# Altium schematic sheet EMoC_Contoller.SchDoc
size A4
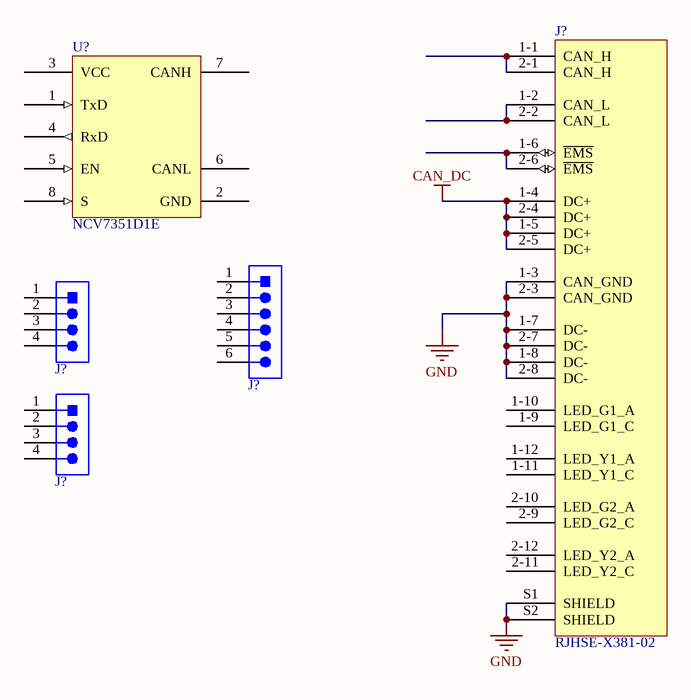
[diagram p0: EMoC_Contoller.SchDoc]

## Parts
(Parts that share a designator on the sheet are numbered #1, #2 ... from top to bottom, then left to right.)
J?#1  S6B-ZR  [S6B-ZR]  (value not drawn)
J?#2  1744426-4  [1744426-4]  (value not drawn)
J?#3  RJHSE-X381-02  [RJHSE-X38X-02]
J?#4  1744426-4  [1744426-4]  (value not drawn)
U?  NCV7351D1E  [SOIC127P600X175-8N]

## Nets
CAN_DC: J?#3.1-4(DC+) J?#3.1-5(DC+) J?#3.2-4(DC+) J?#3.2-5(DC+)
GND: J?#3.1-3(CAN_GND) J?#3.1-7(DC-) J?#3.1-8(DC-) J?#3.2-3(CAN_GND) J?#3.2-7(DC-) J?#3.2-8(DC-) J?#3.S1(SHIELD) J?#3.S2(SHIELD)
NetJ?#3_1-1: J?#3.1-1(CAN_H) J?#3.2-1(CAN_H)
NetJ?#3_1-2: J?#3.1-2(CAN_L) J?#3.2-2(CAN_L)
NetJ?#3_1-6: J?#3.1-6(~{EMS}) J?#3.2-6(~{EMS})

Not connected (* = marked no-connect by the designer): J?#1 1 2 3 4 5 6; J?#2 1 2 3 4; J?#3 1-9(LED_G1_C) 1-10(LED_G1_A) 1-11(LED_Y1_C) 1-12(LED_Y1_A) 2-9(LED_G2_C) 2-10(LED_G2_A) 2-11(LED_Y2_C) 2-12(LED_Y2_A); J?#4 1 2 3 4; U? 1(TxD) 2(GND) 3(VCC) 4(RxD) 5(EN) 6(CANL) 7(CANH) 8(S)

## Library data of the parts
J?#1 = S6B-ZR: CON, HEADER, 6POS, 1.5mm, R/A, THT; Manufacturer 1: JST; Manufacturer Part Number 1: S6B-ZR
J?#2 J?#4 = 1744426-4: CON, HEADER, EP2.5, 4POS, R/A, THT; Manufacturer 1: TE Connectivity; Manufacturer Part Number 1: 1744426-4
U? = CMP-014-0000-1: Source: libysk_passive.SchLib; Design Item ID: NCV7351D1E